# EAGLE schematic RFWBBoard (EAGLE 6.4)
AUTHOR: Benjamin Babjak; AUTHOREMAIL: benjamin.babjak@vanderbilt.edu; COPYRIGHT: Copyright © 2013 Vanderbilt University, ISIS; PAGE1: Cover page; PAGE2: Connector; PAGE3: Baseband signals; PAGE4: RF signals; PAGE5: Control/Digital signals; PAGE6: Clock; PAGE7: Supply; REVIEWER1: Peter Volgyesi; REVIEWER2: Sandor Szilvasi; REVIEWEREMAIL1: peter.volgyesi@vanderbilt.edu; REVIEWEREMAIL2: sandor.szilvasi@vanderbilt.edu; REVISION: B; TITLE: Joshua

## Sheet 1 of 7
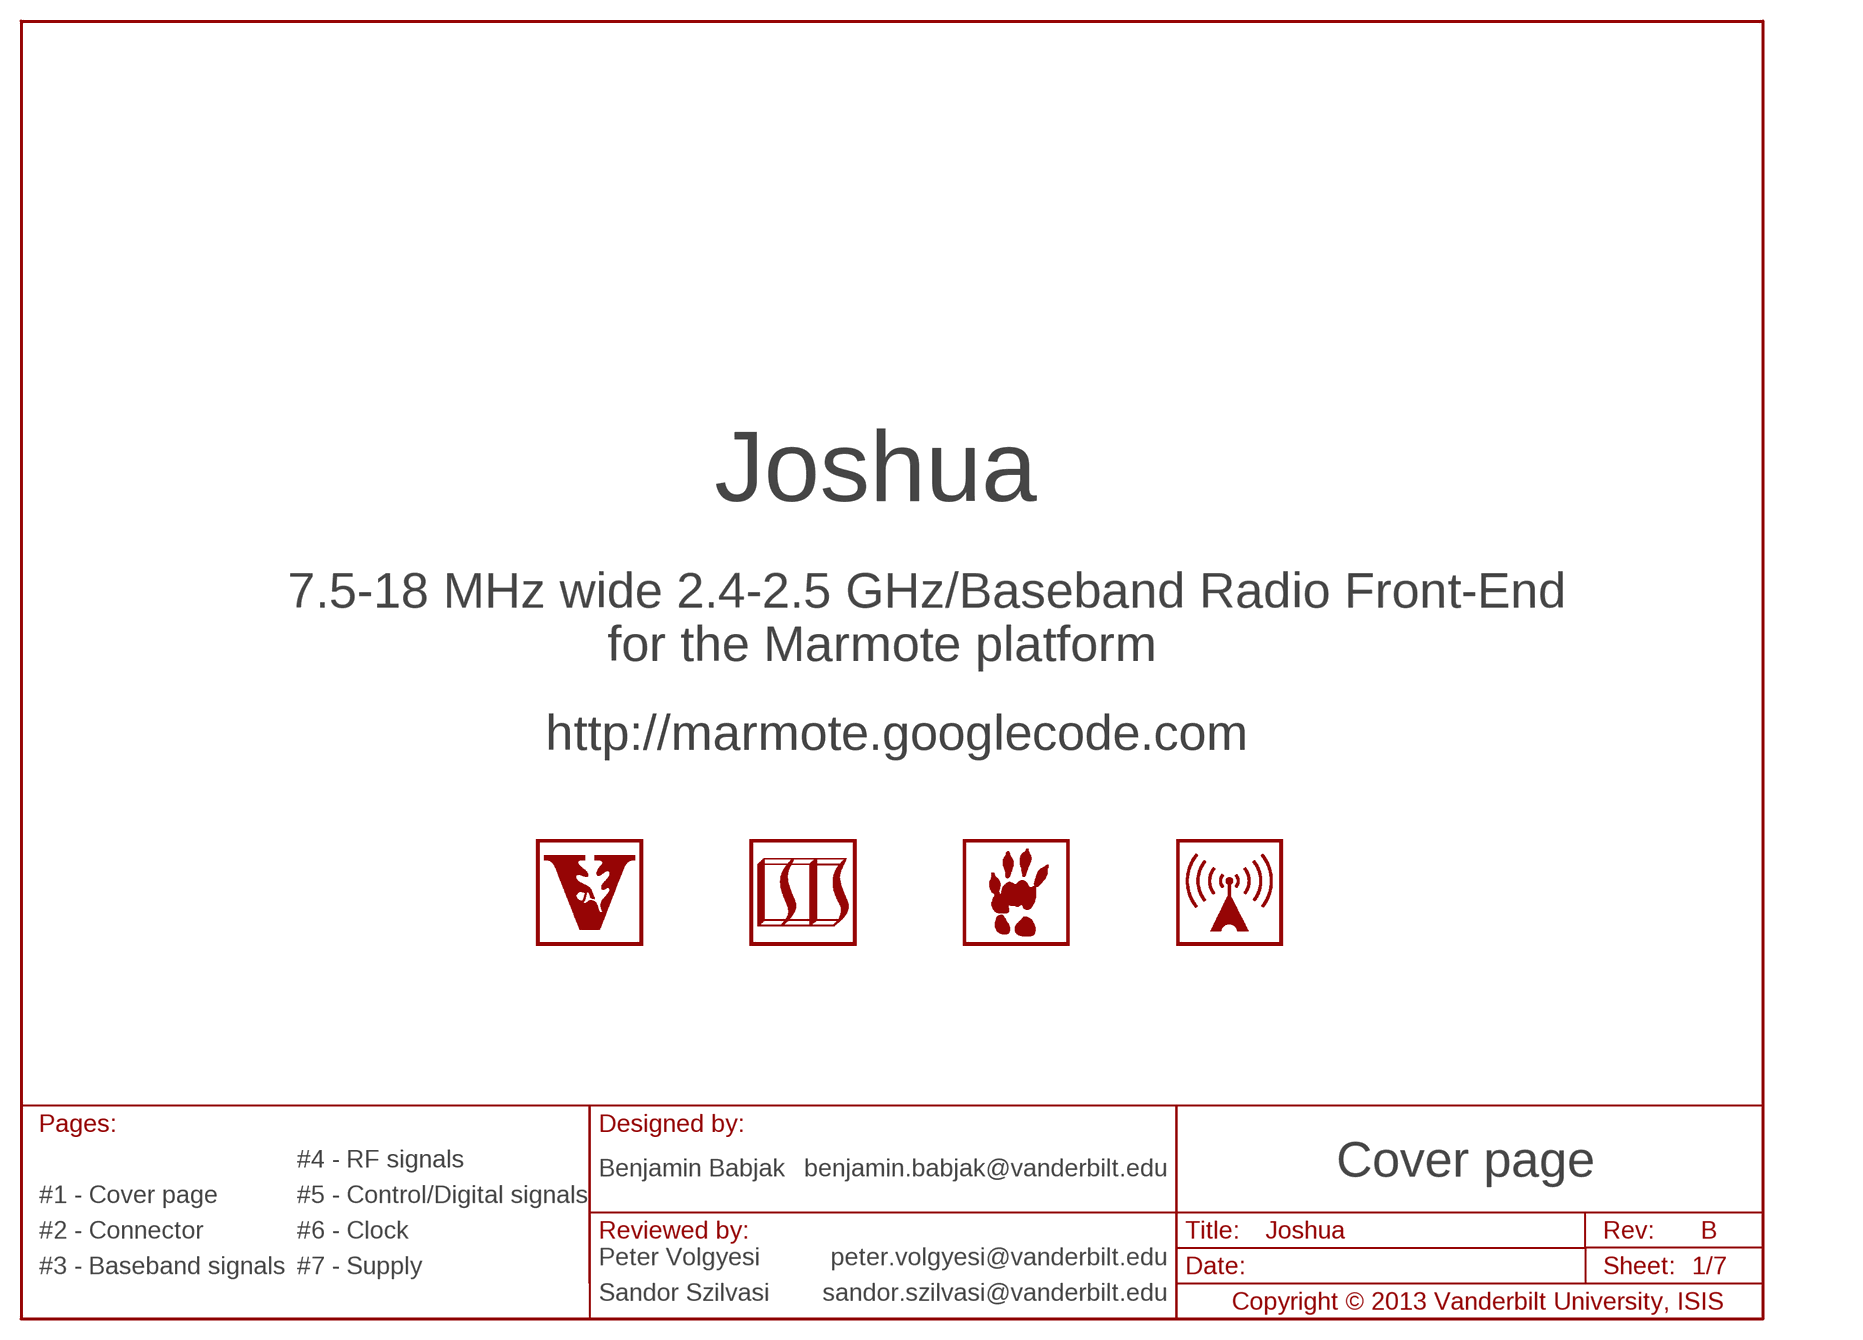
[diagram p0: schematic, sheet 1]

### Parts
LOGO4  LOGO-ISIS-600MIL-10MM-SS  [LOGO-ISIS-10MM-SILKSCREEN]
LOGO5  LOGO-VANDERBILT-600MIL-10MM-SS  [LOGO-VANDERBILT-10MM-SILKSCREEN]
LOGO6  LOGO-MARMOTE-600MIL-10MM-SS  [LOGO-MARMOTE-10MM-SILKSCREEN]
LOGO7  LOGO-RADIO-3-600MIL-10MM-SS  [LOGO-RADIO-FILLED-10MM-SILKSCREEN]

### Notes on the sheet
- 7.5-18 MHz wide 2.4-2.5 GHz/Baseband Radio Front-End
- for the Marmote platform
- http://marmote.googlecode.com

## Sheet 2 of 7
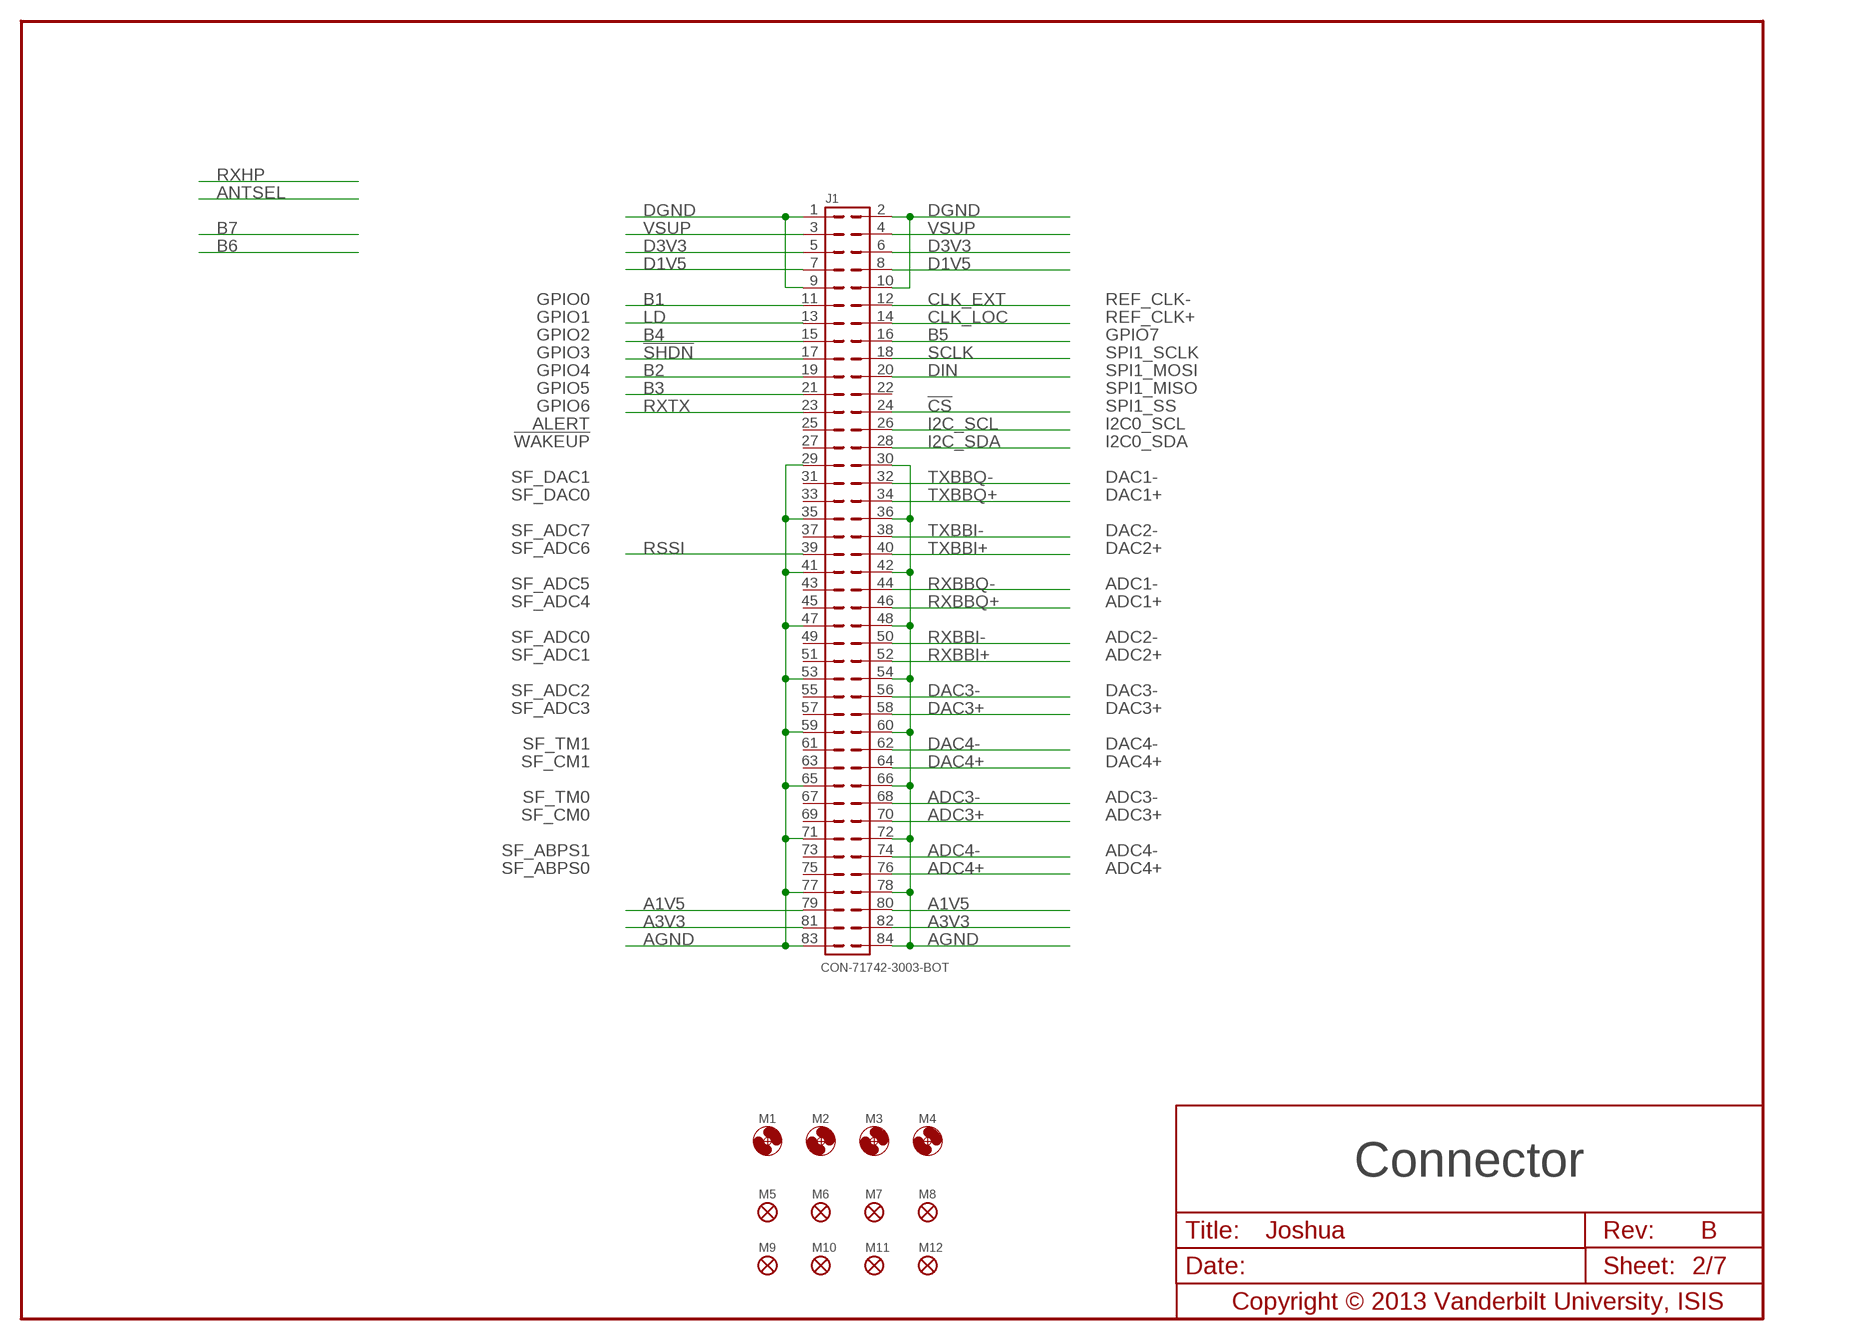
[diagram p1: schematic, sheet 2]

### Parts
J1  CON-71742-3003-BOT  [71742-3003-BOT]
M1  MOUNT-HOLE3.3  [3,3]
M2  MOUNT-HOLE3.3  [3,3]
M3  MOUNT-HOLE3.3  [3,3]
M4  MOUNT-HOLE3.3  [3,3]
M5  FIDUCIAL1X2  [FIDUCIAL-1X2]
M6  FIDUCIAL1X2  [FIDUCIAL-1X2]
M7  FIDUCIAL1X2  [FIDUCIAL-1X2]
M8  FIDUCIAL1X2  [FIDUCIAL-1X2]
M9  FIDUCIAL1X2  [FIDUCIAL-1X2]
M10  FIDUCIAL1X2  [FIDUCIAL-1X2]
M11  FIDUCIAL1X2  [FIDUCIAL-1X2]
M12  FIDUCIAL1X2  [FIDUCIAL-1X2]

### Nets
!CS: J1.24 ; also sheet 5
!SHDN: J1.17 ; also sheet 5
A1V5: J1.79 J1.80
A3V3: J1.81 J1.82 ; also sheet 3,7
ADC3+: J1.70 ; also sheet 3
ADC3-: J1.68 ; also sheet 3
ADC4+: J1.76 ; also sheet 3
ADC4-: J1.74 ; also sheet 3
AGND: J1.29 J1.30 J1.35 J1.36 J1.41 J1.42 J1.47 J1.48 J1.53 J1.54 J1.59 J1.60 J1.65 J1.66 J1.71 J1.72 J1.77 J1.78 J1.83 J1.84 ; also sheet 3,4,6,7
B1: J1.11 ; also sheet 5
B2: J1.19 ; also sheet 5
B3: J1.21 ; also sheet 5
B4: J1.15 ; also sheet 5
B5: J1.16 ; also sheet 5
CLK_EXT: J1.12 ; also sheet 6
CLK_LOC: J1.14 ; also sheet 6
D1V5: J1.7 J1.8
D3V3: J1.5 J1.6 ; also sheet 5,6
DAC3+: J1.58 ; also sheet 3
DAC3-: J1.56 ; also sheet 3
DAC4+: J1.64 ; also sheet 3
DAC4-: J1.62 ; also sheet 3
DGND: J1.1 J1.2 J1.9 J1.10 ; also sheet 5,6,7
DIN: J1.20 ; also sheet 5
I2C_SCL: J1.26 ; also sheet 5
I2C_SDA: J1.28 ; also sheet 5
LD: J1.13 ; also sheet 6
RSSI: J1.39 ; also sheet 5
RXBBI+: J1.52 ; also sheet 4
RXBBI-: J1.50 ; also sheet 4
RXBBQ+: J1.46 ; also sheet 4
RXBBQ-: J1.44 ; also sheet 4
RXTX: J1.23 ; also sheet 5
SCLK: J1.18 ; also sheet 5
TXBBI+: J1.40 ; also sheet 4
TXBBI-: J1.38 ; also sheet 4
TXBBQ+: J1.34 ; also sheet 4
TXBBQ-: J1.32 ; also sheet 4
VSUP: J1.3 J1.4
Unconnected: J1.22 J1.25 J1.27 J1.31 J1.33 J1.37 J1.43 J1.45 J1.49 J1.51 J1.55 J1.57 J1.61 J1.63 J1.67 J1.69 J1.73 J1.75

### Notes on the sheet
- GPIO0 | REF_CLK-
- GPIO1 | REF_CLK+
- GPIO2 | GPIO7
- GPIO3 | SPI1_SCLK
- GPIO4 | SPI1_MOSI
- GPIO5 | SPI1_MISO
- GPIO6 | SPI1_SS
- ALERT | I2C0_SCL
- !WAKEUP | I2C0_SDA
- SF_DAC1 | DAC1-
- SF_DAC0 | DAC1+
- SF_ADC7 | DAC2-
- SF_ADC6 | DAC2+
- SF_ADC5 | ADC1-
- SF_ADC4 | ADC1+
- SF_ADC0 | ADC2-
- SF_ADC1 | ADC2+
- SF_ADC2 | DAC3-
- SF_ADC3 | DAC3+
- SF_TM1 | DAC4-
- SF_CM1 | DAC4+
- SF_TM0 | ADC3-
- SF_CM0 | ADC3+
- SF_ABPS1 | ADC4-
- SF_ABPS0 | ADC4+

## Sheet 3 of 7
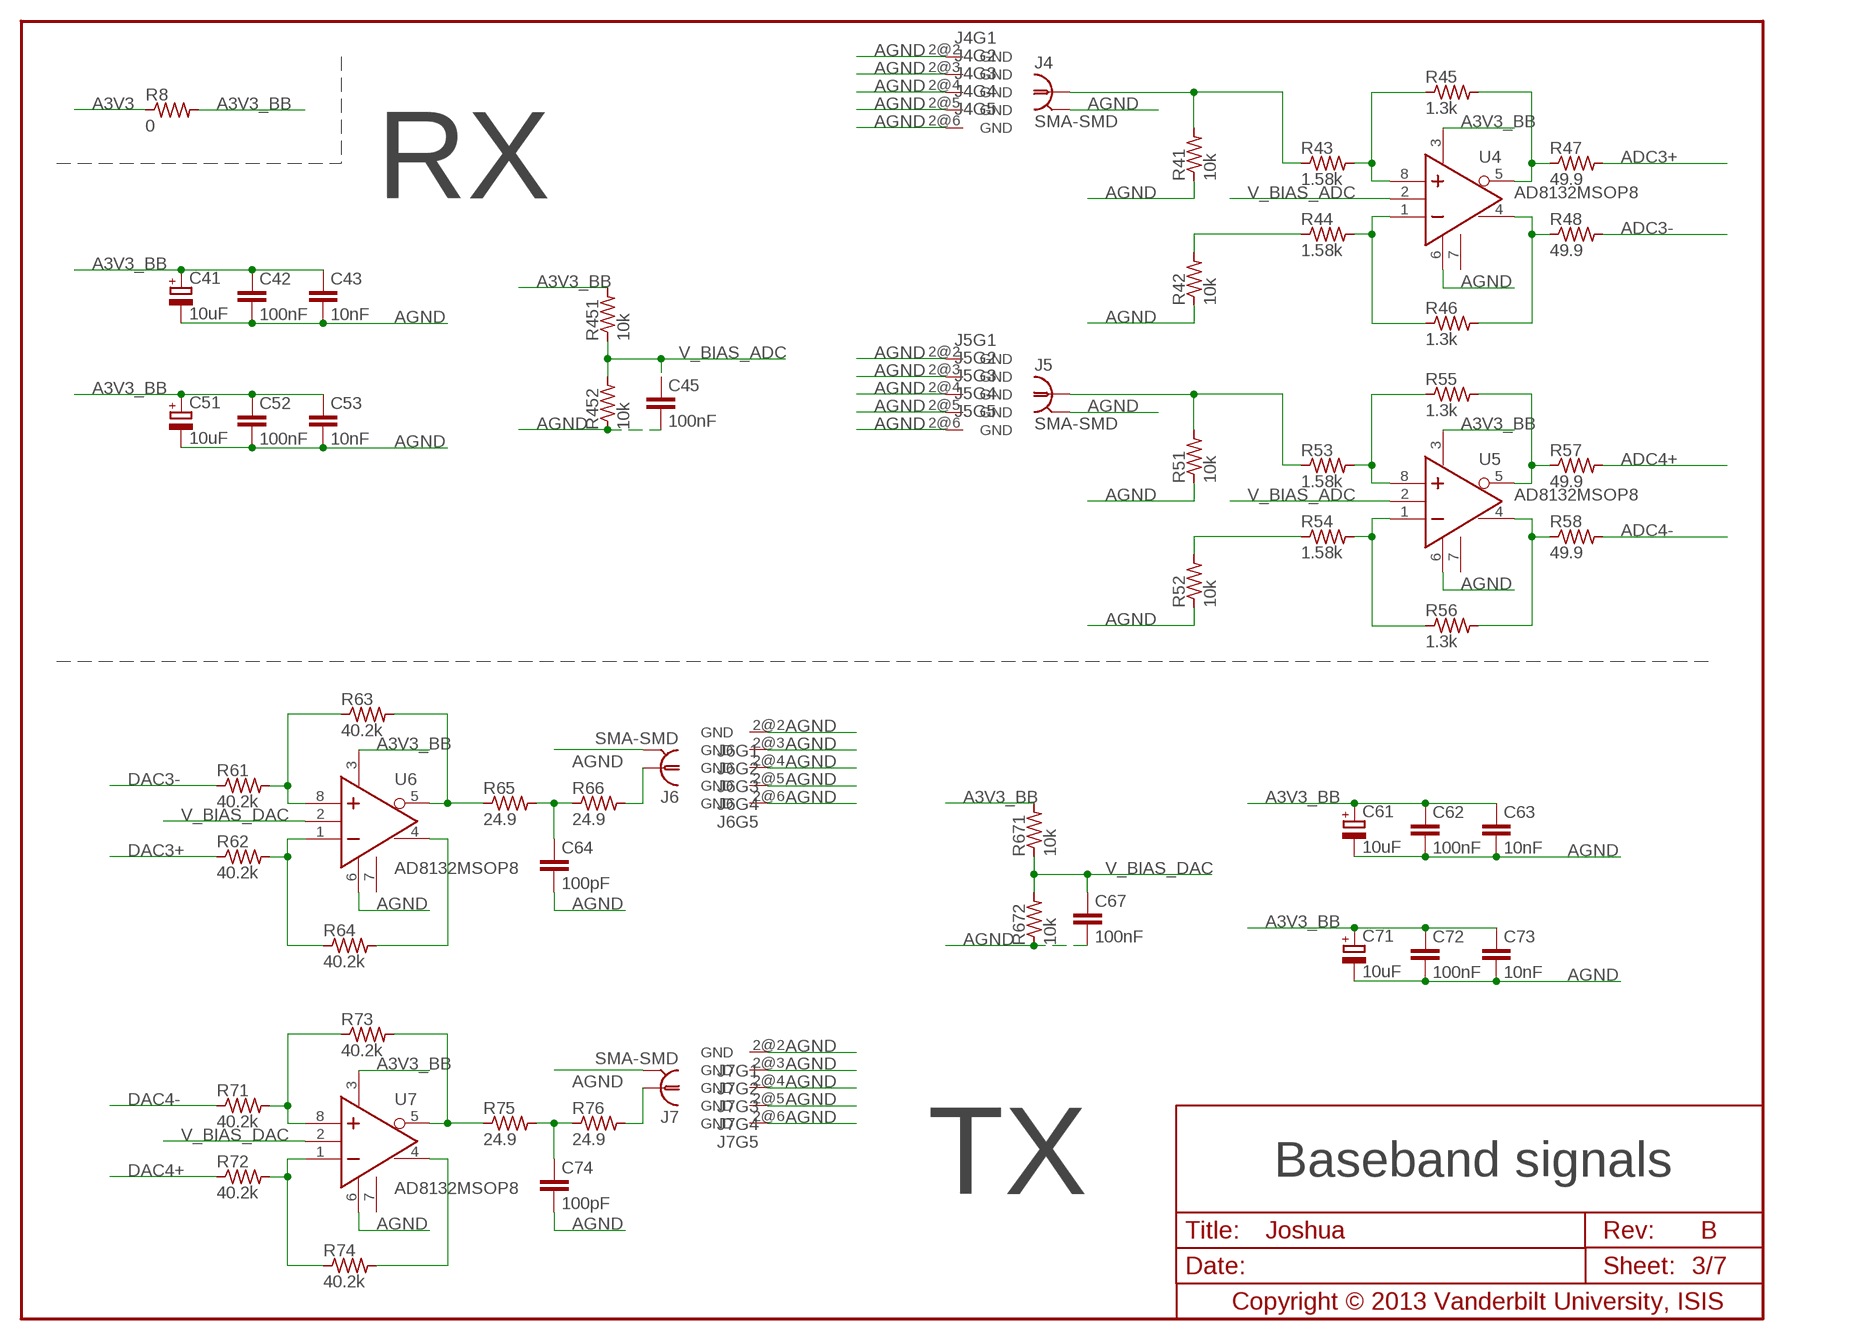
[diagram p2: schematic, sheet 3]

### Parts
C41  10uF  CPOL2012  [CPOL2012]
C42  100nF  C0402  [C0402]
C43  10nF  C0402  [C0402]
C45  100nF  C0402  [C0402]
C51  10uF  CPOL2012  [CPOL2012]
C52  100nF  C0402  [C0402]
C53  10nF  C0402  [C0402]
C61  10uF  CPOL2012  [CPOL2012]
C62  100nF  C0402  [C0402]
C63  10nF  C0402  [C0402]
C64  100pF  C0402  [C0402]
C67  100nF  C0402  [C0402]
C71  10uF  CPOL2012  [CPOL2012]
C72  100nF  C0402  [C0402]
C73  10nF  C0402  [C0402]
C74  100pF  C0402  [C0402]
J4  SMA-SMD  [SMA-SMD]
J5  SMA-SMD  [SMA-SMD]
J6  SMA-SMD  [SMA-SMD]
J7  SMA-SMD  [SMA-SMD]
R8  0  R1206  [R1206]
R41  10k  R0402  [R0402]
R42  10k  R0402  [R0402]
R43  1.58k  R0402  [R0402]
R44  1.58k  R0402  [R0402]
R45  1.3k  R0402  [R0402]
R46  1.3k  R0402  [R0402]
R47  49.9  R0402  [R0402]
R48  49.9  R0402  [R0402]
R51  10k  R0402  [R0402]
R52  10k  R0402  [R0402]
R53  1.58k  R0402  [R0402]
R54  1.58k  R0402  [R0402]
R55  1.3k  R0402  [R0402]
R56  1.3k  R0402  [R0402]
R57  49.9  R0402  [R0402]
R58  49.9  R0402  [R0402]
R61  40.2k  R0402  [R0402]
R62  40.2k  R0402  [R0402]
R63  40.2k  R0402  [R0402]
R64  40.2k  R0402  [R0402]
R65  24.9  R0402  [R0402]
R66  24.9  R0402  [R0402]
R71  40.2k  R0402  [R0402]
R72  40.2k  R0402  [R0402]
R73  40.2k  R0402  [R0402]
R74  40.2k  R0402  [R0402]
R75  24.9  R0402  [R0402]
R76  24.9  R0402  [R0402]
R451  10k  R0402  [R0402]
R452  10k  R0402  [R0402]
R671  10k  R0402  [R0402]
R672  10k  R0402  [R0402]
U4  AD8132MSOP8  [MSOP8]
U5  AD8132MSOP8  [MSOP8]
U6  AD8132MSOP8  [MSOP8]
U7  AD8132MSOP8  [MSOP8]

### Nets
A3V3: R8.1 ; also sheet 2,7
A3V3_BB: C41.+ C42.1 C43.1 C51.+ C52.1 C53.1 C61.+ C62.1 C63.1 C71.+ C72.1 C73.1 R8.2 R451.2 R671.2 U4.3(V_S+) U5.3(V_S+) U6.3(V_S+) U7.3(V_S+)
ADC3+: R47.2 ; also sheet 2
ADC3-: R48.2 ; also sheet 2
ADC4+: R57.2 ; also sheet 2
ADC4-: R58.2 ; also sheet 2
AGND: C41.- C42.2 C43.2 C45.2 C51.- C52.2 C53.2 C61.- C62.2 C63.2 C64.2 C67.2 C71.- C72.2 C73.2 C74.2 J4.2@1(GND) J4.2@2(GND) J4.2@3(GND) J4.2@4(GND) J4.2@5(GND) J4.2@6(GND) J5.2@1(GND) J5.2@2(GND) J5.2@3(GND) J5.2@4(GND) J5.2@5(GND) J5.2@6(GND) J6.2@1(GND) J6.2@2(GND) J6.2@3(GND) J6.2@4(GND) J6.2@5(GND) J6.2@6(GND) J7.2@1(GND) J7.2@2(GND) J7.2@3(GND) J7.2@4(GND) J7.2@5(GND) J7.2@6(GND) R41.1 R42.1 R51.1 R52.1 R452.1 R672.1 U4.6(V_S-) U5.6(V_S-) U6.6(V_S-) U7.6(V_S-) ; also sheet 2,4,6,7
DAC3+: R62.1 ; also sheet 2
DAC3-: R61.1 ; also sheet 2
DAC4+: R72.1 ; also sheet 2
DAC4-: R71.1 ; also sheet 2
N$11: J4.1 R41.2 R43.1
N$12: R45.2 R47.1 U4.5(-OUT)
N$13: R46.2 R48.1 U4.4(+OUT)
N$14: R43.2 R45.1 U4.8(+IN)
N$15: R44.2 R46.1 U4.1(-IN)
N$16: J5.1 R51.2 R53.1
N$17: R42.2 R44.1
N$18: R55.2 R57.1 U5.5(-OUT)
N$19: R56.2 R58.1 U5.4(+OUT)
N$20: R53.2 R55.1 U5.8(+IN)
N$21: R54.2 R56.1 U5.1(-IN)
N$22: R52.2 R54.1
N$23: R61.2 R63.1 U6.8(+IN)
N$24: R62.2 R64.1 U6.1(-IN)
N$25: R63.2 R65.1 U6.5(-OUT)
N$26: R64.2 U6.4(+OUT)
N$27: C64.1 R65.2 R66.1
N$28: R71.2 R73.1 U7.8(+IN)
N$29: J6.1 R66.2
N$30: R72.2 R74.1 U7.1(-IN)
N$31: R73.2 R75.1 U7.5(-OUT)
N$32: R74.2 U7.4(+OUT)
N$33: C74.1 R75.2 R76.1
N$34: J7.1 R76.2
V_BIAS_ADC: C45.1 R451.1 R452.2 U4.2(V_OCM) U5.2(V_OCM)
V_BIAS_DAC: C67.1 R671.1 R672.2 U6.2(V_OCM) U7.2(V_OCM)
Unconnected: U4.7(PD) U5.7(PD) U6.7(PD) U7.7(PD)

### Notes on the sheet
- RX
- TX

## Sheet 4 of 7
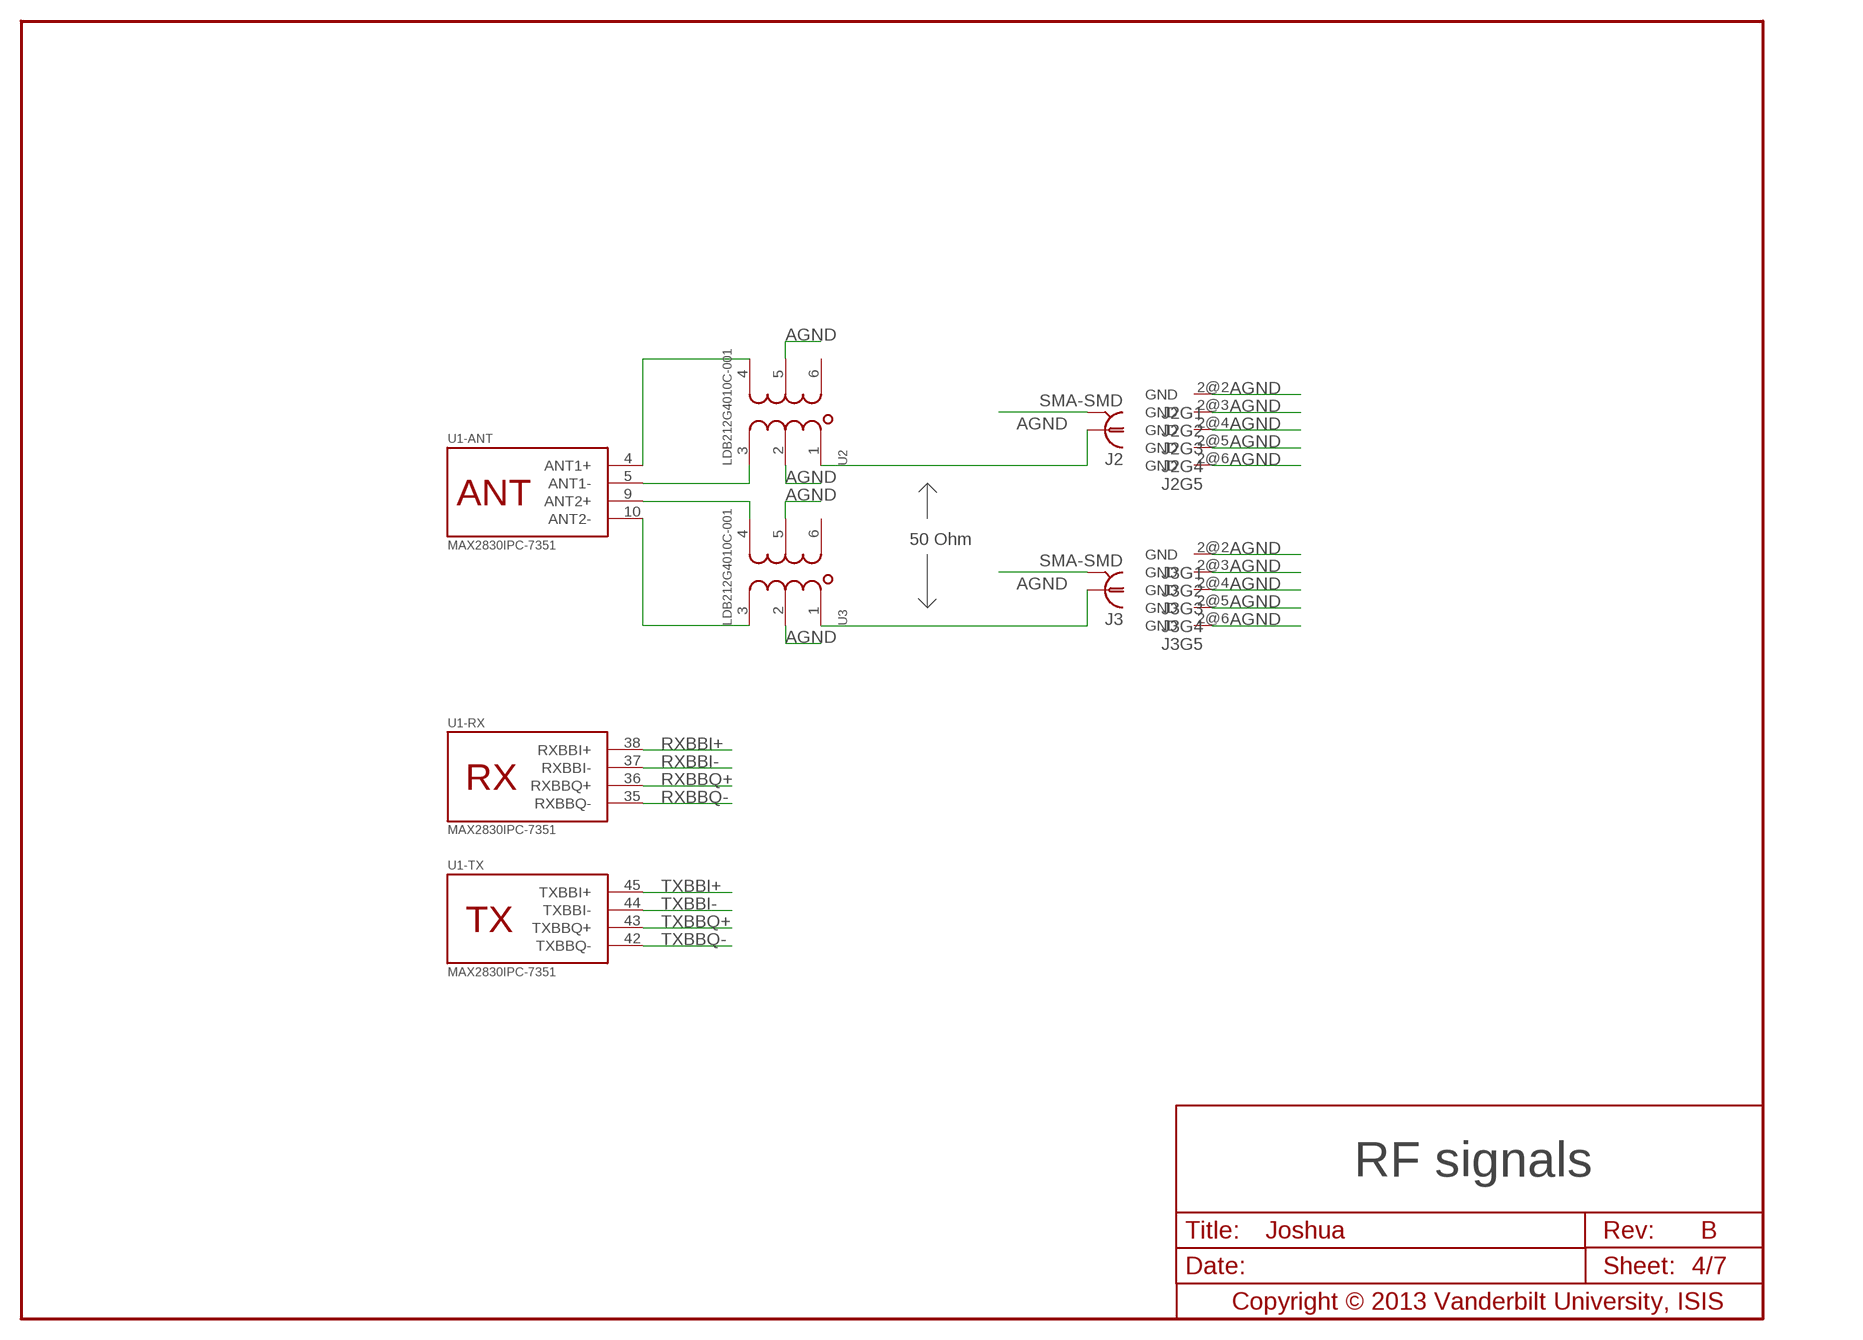
[diagram p3: schematic, sheet 4]

### Parts
J2  SMA-SMD  [SMA-SMD]
J3  SMA-SMD  [SMA-SMD]
U1  MAX2830IPC-7351  [TQFN-48]
U2  LDB212G4010C-001  [LDB21-FOOTPRINT]
U3  LDB212G4010C-001  [LDB21-FOOTPRINT]

### Nets
AGND: J2.2@1(GND) J2.2@2(GND) J2.2@3(GND) J2.2@4(GND) J2.2@5(GND) J2.2@6(GND) J3.2@1(GND) J3.2@2(GND) J3.2@3(GND) J3.2@4(GND) J3.2@5(GND) J3.2@6(GND) U2.2 U2.5 U3.2 U3.5 ; also sheet 2,3,6,7
N$1: U1.4(-ANT:ANT1+) U2.4
N$2: U1.5(-ANT:ANT1-) U2.3
N$3: U1.10(-ANT:ANT2-) U3.3
N$4: U1.9(-ANT:ANT2+) U3.4
N$8: J2.1 U2.1
N$9: J3.1 U3.1
RXBBI+: U1.38(-RX:RXBBI+) ; also sheet 2
RXBBI-: U1.37(-RX:RXBBI-) ; also sheet 2
RXBBQ+: U1.36(-RX:RXBBQ+) ; also sheet 2
RXBBQ-: U1.35(-RX:RXBBQ-) ; also sheet 2
TXBBI+: U1.45(-TX:TXBBI+) ; also sheet 2
TXBBI-: U1.44(-TX:TXBBI-) ; also sheet 2
TXBBQ+: U1.43(-TX:TXBBQ+) ; also sheet 2
TXBBQ-: U1.42(-TX:TXBBQ-) ; also sheet 2
Unconnected: U2.6 U3.6

### Notes on the sheet
- 50 Ohm

## Sheet 5 of 7
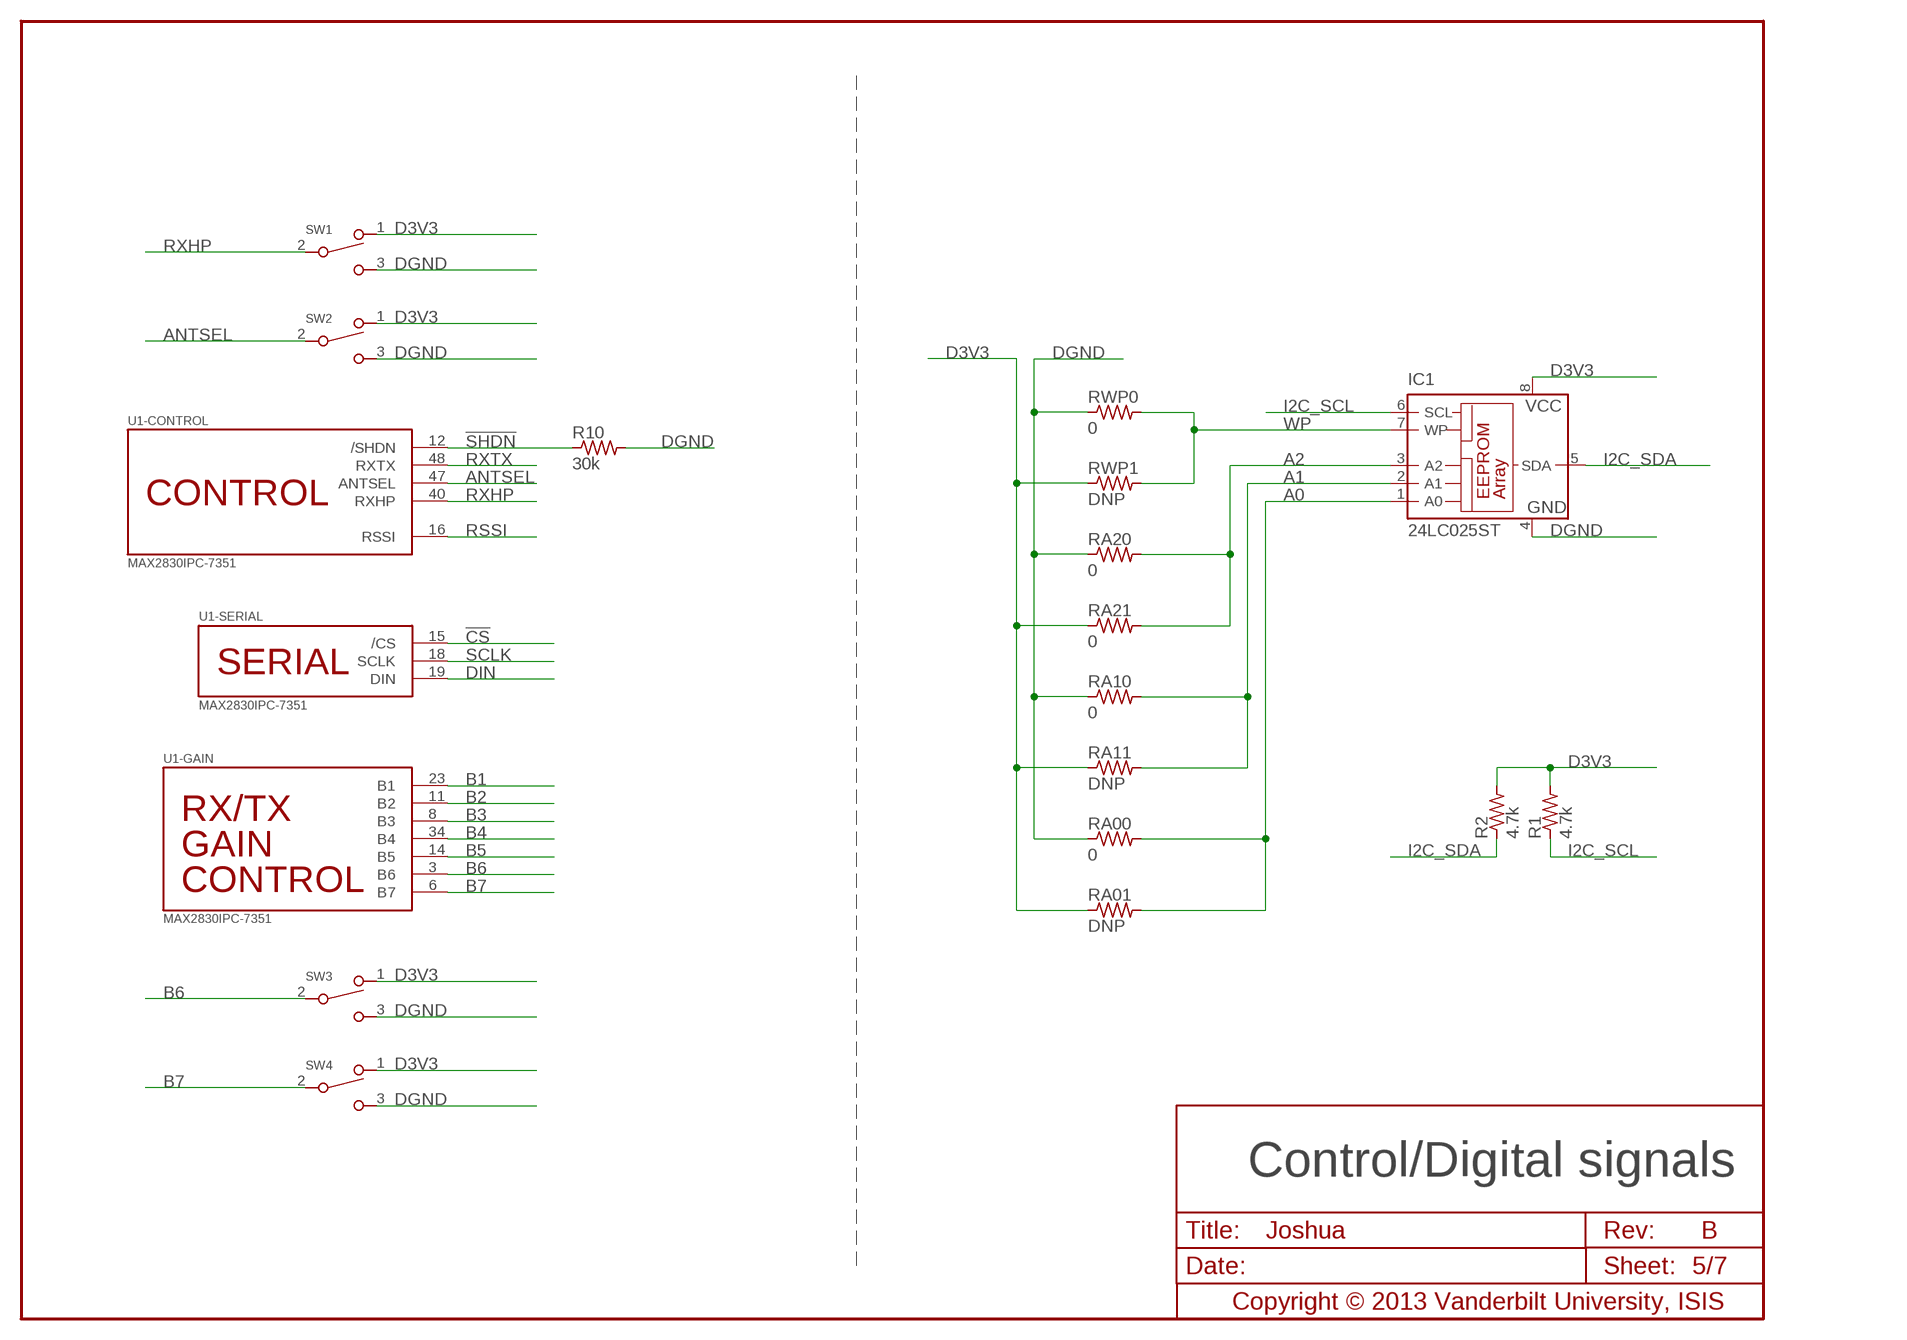
[diagram p4: schematic, sheet 5]

### Parts
IC1  24LC025ST  [TSSOP8]
R1  4.7k  R0402  [R0402]
R2  4.7k  R0402  [R0402]
R10  30k  R0402  [R0402]
RA00  0  R0402  [R0402]
RA01  DNP  R0402  [R0402]
RA10  0  R0402  [R0402]
RA11  DNP  R0402  [R0402]
RA20  0  R0402  [R0402]
RA21  0  R0402  [R0402]
RWP0  0  R0402  [R0402]
RWP1  DNP  R0402  [R0402]
SW1  SWITCH-CJS-1200TA  [SWITCH-DIP-CJS]
SW2  SWITCH-CJS-1200TA  [SWITCH-DIP-CJS]
SW3  SWITCH-CJS-1200TA  [SWITCH-DIP-CJS]
SW4  SWITCH-CJS-1200TA  [SWITCH-DIP-CJS]

### Nets
!CS: U1.15(-SERIAL:/CS) ; also sheet 2
!SHDN: R10.1 U1.12(-CONTROL:/SHDN) ; also sheet 2
A0: IC1.1(A0) RA00.2 RA01.2
A1: IC1.2(A1) RA10.2 RA11.2
A2: IC1.3(A2) RA20.2 RA21.2
ANTSEL: SW2.2 U1.47(-CONTROL:ANTSEL) ; also sheet 2
B1: U1.23(-GAIN:B1) ; also sheet 2
B2: U1.11(-GAIN:B2) ; also sheet 2
B3: U1.8(-GAIN:B3) ; also sheet 2
B4: U1.34(-GAIN:B4) ; also sheet 2
B5: U1.14(-GAIN:B5) ; also sheet 2
B6: SW3.2 U1.3(-GAIN:B6) ; also sheet 2
B7: SW4.2 U1.6(-GAIN:B7) ; also sheet 2
D3V3: IC1.8(VCC) R1.2 R2.2 RA01.1 RA11.1 RA21.1 RWP1.1 SW1.1 SW2.1 SW3.1 SW4.1 ; also sheet 2,6
DGND: IC1.4(GND) R10.2 RA00.1 RA10.1 RA20.1 RWP0.1 SW1.3 SW2.3 SW3.3 SW4.3 ; also sheet 2,6,7
DIN: U1.19(-SERIAL:DIN) ; also sheet 2
I2C_SCL: IC1.6(SCL) R1.1 ; also sheet 2
I2C_SDA: IC1.5(SDA) R2.1 ; also sheet 2
RSSI: U1.16(-CONTROL:RSSI) ; also sheet 2
RXHP: SW1.2 U1.40(-CONTROL:RXHP) ; also sheet 2
RXTX: U1.48(-CONTROL:RXTX) ; also sheet 2
SCLK: U1.18(-SERIAL:SCLK) ; also sheet 2
WP: IC1.7(WP) RWP0.2 RWP1.2

## Sheet 6 of 7
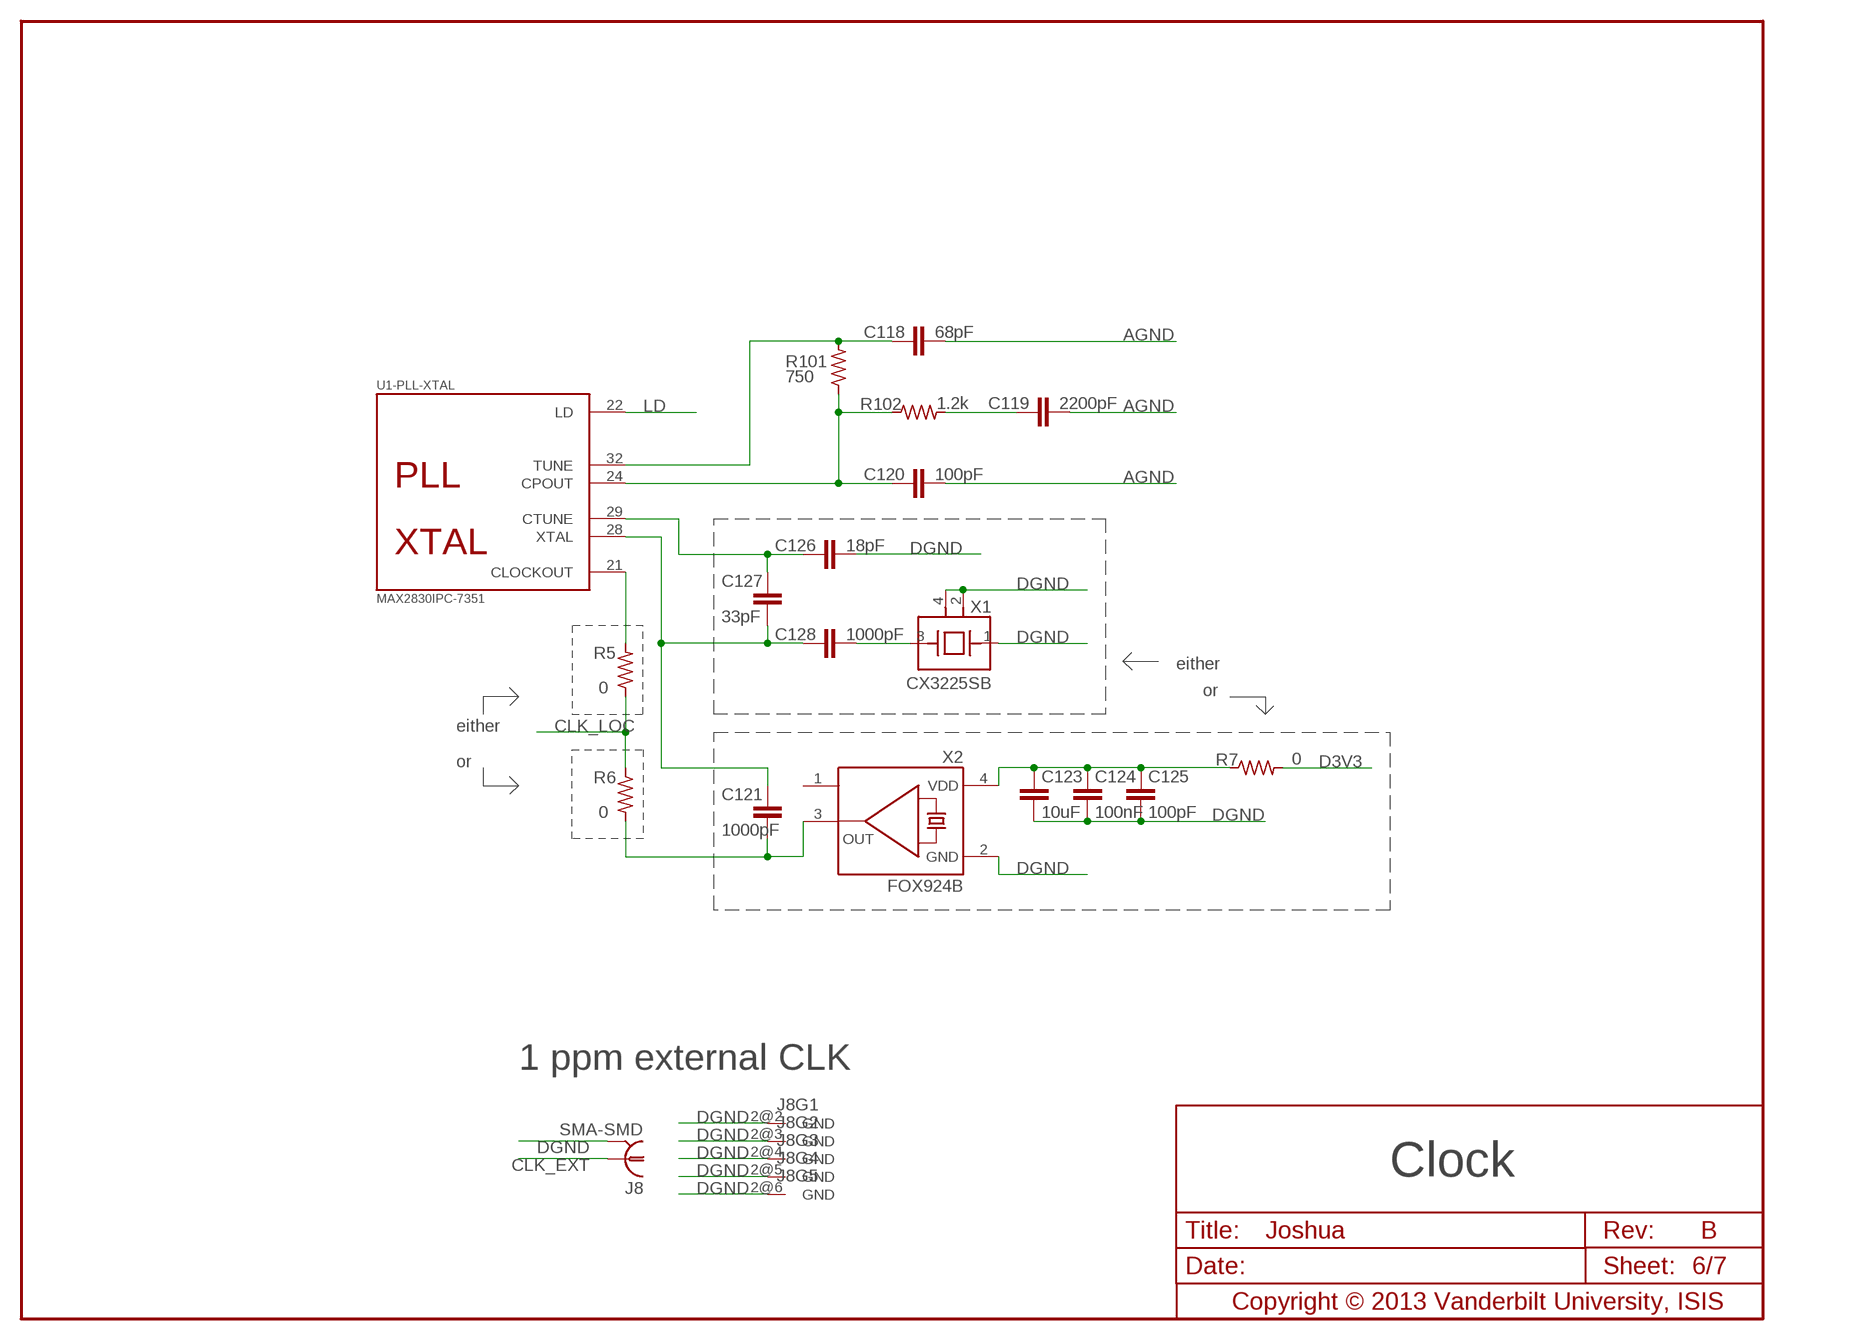
[diagram p5: schematic, sheet 6]

### Parts
C118  68pF  C0402  [C0402]
C119  2200pF  C0402  [C0402]
C120  100pF  C0402  [C0402]
C121  1000pF  C0402  [C0402]
C123  10uF  C0805  [C0805]
C124  100nF  C0402  [C0402]
C125  100pF  C0402  [C0402]
C126  18pF  C0402  [C0402]
C127  33pF  C0402  [C0402]
C128  1000pF  C0402  [C0402]
J8  SMA-SMD  [SMA-SMD]
R5  0  R0402  [R0402]
R6  0  R0402  [R0402]
R7  0  R1206  [R1206]
R101  750  R0402  [R0402]
R102  1.2k  R0402  [R0402]
X1  CX3225SB  [CX3225SB]
X2  FOX924B  [FOX924]

### Nets
AGND: C118.2 C119.2 C120.2 ; also sheet 2,3,4,7
CLK_EXT: J8.1 ; also sheet 2
CLK_LOC: R5.1 R6.1 ; also sheet 2
D3V3: R7.2 ; also sheet 2,5
DGND: C123.2 C124.2 C125.2 C126.1 J8.2@1(GND) J8.2@2(GND) J8.2@3(GND) J8.2@4(GND) J8.2@5(GND) J8.2@6(GND) X1.1 X1.2 X1.4 X2.2(GND) ; also sheet 2,5,7
LD: U1.22(-PLL-XTAL:LD) ; also sheet 2
N$5: C118.1 R101.2 U1.32(-PLL-XTAL:TUNE)
N$6: C121.1 C127.2 C128.2 U1.28(-PLL-XTAL:XTAL)
N$7: C119.1 R102.2
N$10: C120.1 R101.1 R102.1 U1.24(-PLL-XTAL:CPOUT)
N$36: C121.2 R6.2 X2.3(FO)
N$37: C123.1 C124.1 C125.1 R7.1 X2.4(VCC)
N$38: R5.2 U1.21(-PLL-XTAL:CLOCKOUT)
N$39: C128.1 X1.3
N$40: C126.2 C127.1 U1.29(-PLL-XTAL:CTUNE)
Unconnected: X2.1(NC)

### Notes on the sheet
- either
- or
- either
- or
- 1 ppm external CLK

## Sheet 7 of 7
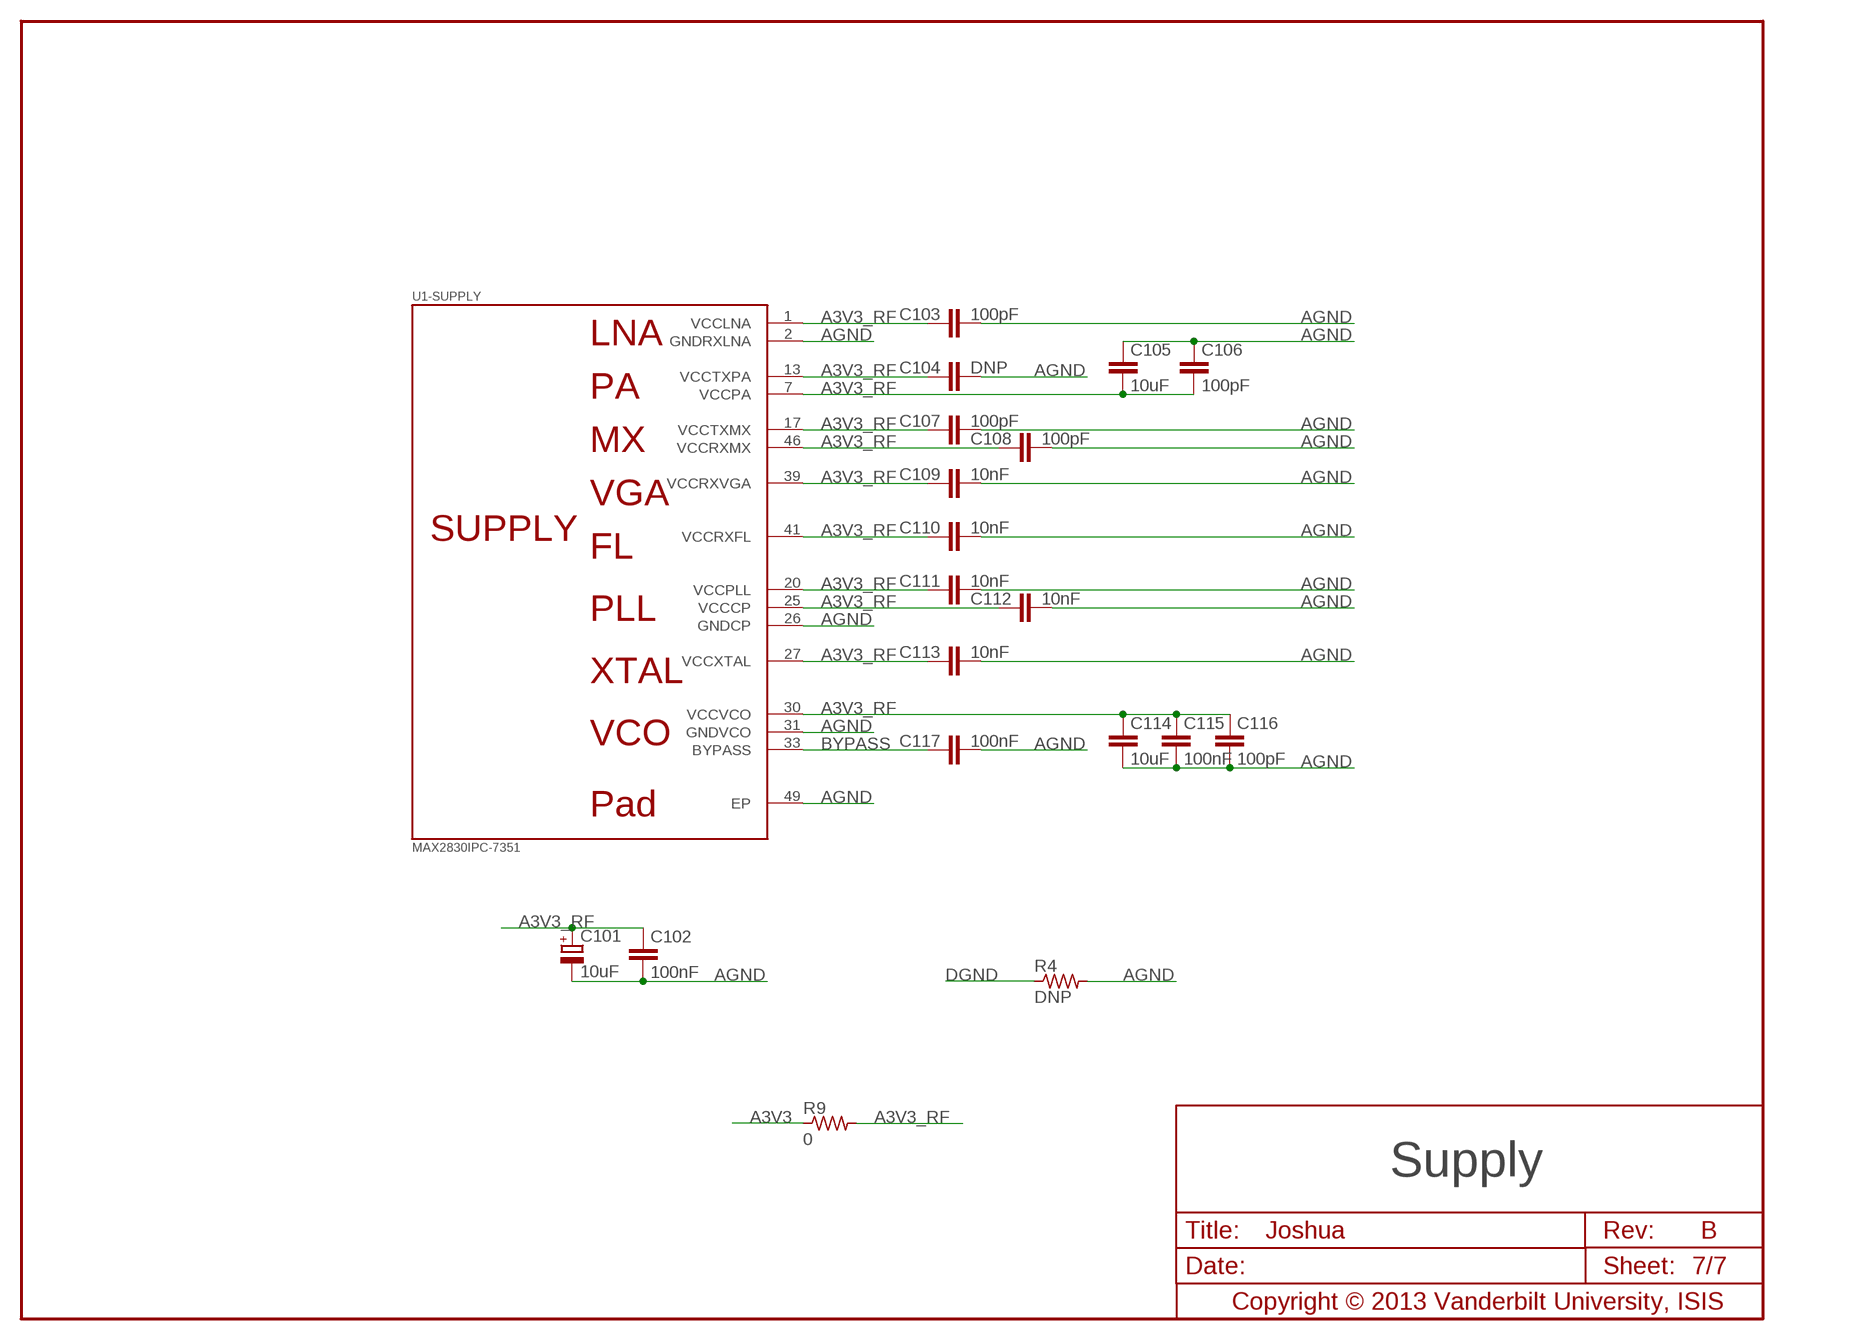
[diagram p6: schematic, sheet 7]

### Parts
C101  10uF  CPOL2012  [CPOL2012]
C102  100nF  C0402  [C0402]
C103  100pF  C0402  [C0402]
C104  DNP  C0402  [C0402]
C105  10uF  C1206  [C1206]
C106  100pF  C0402  [C0402]
C107  100pF  C0402  [C0402]
C108  100pF  C0402  [C0402]
C109  10nF  C0402  [C0402]
C110  10nF  C0402  [C0402]
C111  10nF  C0402  [C0402]
C112  10nF  C0402  [C0402]
C113  10nF  C0402  [C0402]
C114  10uF  C0805  [C0805]
C115  100nF  C0402  [C0402]
C116  100pF  C0402  [C0402]
C117  100nF  C0402  [C0402]
R4  DNP  R1206  [R1206]
R9  0  R1206  [R1206]

### Nets
A3V3: R9.1 ; also sheet 2,3
A3V3_RF: C101.+ C102.1 C103.1 C104.1 C105.2 C106.2 C107.1 C108.1 C109.1 C110.1 C111.1 C112.1 C113.1 C114.1 C115.1 C116.1 R9.2 U1.1(-SUPPLY:VCCLNA) U1.7(-SUPPLY:VCCPA) U1.13(-SUPPLY:VCCTXPA) U1.17(-SUPPLY:VCCTXMX) U1.20(-SUPPLY:VCCPLL) U1.25(-SUPPLY:VCCCP) U1.27(-SUPPLY:VCCXTAL) U1.30(-SUPPLY:VCCVCO) U1.39(-SUPPLY:VCCRXVGA) U1.41(-SUPPLY:VCCRXFL) U1.46(-SUPPLY:VCCRXMX)
AGND: C101.- C102.2 C103.2 C104.2 C105.1 C106.1 C107.2 C108.2 C109.2 C110.2 C111.2 C112.2 C113.2 C114.2 C115.2 C116.2 C117.2 R4.2 U1.2(-SUPPLY:GNDRXLNA) U1.26(-SUPPLY:GNDCP) U1.31(-SUPPLY:GNDVCO) U1.49(-SUPPLY:EP) ; also sheet 2,3,4,6
BYPASS: C117.1 U1.33(-SUPPLY:BYPASS)
DGND: R4.1 ; also sheet 2,5,6

## Library data of the parts
C41 C51 C61 C71 C101 = RFWBBoard:CPOL: POLARIZED CAPACITOR Tantalum capacitors
C42 C43 C45 C52 C53 C62-C64 C67 C72-C74 C102-C121 C123-C128 = RFWBBoard:C: CAPACITOR
IC1 = RFWBBoard:24*: Serial EEPROM I2C; MF: MICROCHIP; MPN: 24LC025-I/ST; OC_FARNELL: unknown; OC_NEWARK: 92C7100
J1 = RFWBBoard:CON-71742: Board-to-Board Connector 1.00mm (.039") Mezzanine IEEE 1386 Receptacle - Dual Row 64-pin, SMT, Vertical Stacking Source: http://www.molex.com/molex/products/datasheet.jsp?part=active/0714392164_PCB_RECEPTACLES.xml&channel=Products
J2-J8 = RFWBBoard:SMA-SMD: SMA 50 Ohm Straight Jack Receptacle - Surface Mount www.johnsoncomponents.com Source: http://catalog.digikey.com .. 142-0711-201, 205, 202, 206.pdf; OC_FARNELL: unknown; OC_NEWARK: unknown
LOGO4 = Logo:LOGO-ISIS-600MIL: ISIS Logo Official logo of the Institute for Software Integrated Systems (ISIS), Vanderbilt as of 2011 Generated from 360 x 360 px bitmap and scaled to 600 x 600 mil v1.0 Initial design
LOGO5 = Logo:LOGO-VANDERBILT-600MIL: Vanderbilt Logo Official Framed Vanderbilt Logo Generated from 360 x 360 px bitmap and scaled to 600 x 600 mil v1.1 Source bitmap smoothened v1.0 Initial design
LOGO6 = Logo:LOGO-MARMOTE-600MIL: Marmote Platform Logo Preliminary logo for the Marmote Platform (http://marmote.googlecode.com) Generated from 360 x 360 px bitmap and scaled to 600 x 600 mil v1.1 Source bitmap smoothened v1.0 Initial design
LOGO7 = Logo:LOGO-RADIO-3-600MIL: Radio Logo Preliminary logo for the Marmote platform analog radio front-end module. Generated from 360 x 360 px bitmap and scaled to 600 x 600 mil v1.0 Initial design
M1-M4 = RFWBBoard:MOUNT-HOLE: MOUNTING HOLE with drill center marker
M5-M12 = RFWBBoard:FIDUCIAL: Fiducial Alignment Points Various fiducial points for machine vision alignment.
R1 R2 R4-R10 R41-R48 R51-R58 R61-R66 R71-R76 R101 R102 R451 R452 R671 R672 RA00 RA01 RA10 RA11 RA20 RA21 RWP0 RWP1 = RFWBBoard:R: RESISTOR
SW1-SW4 = RFWBBoard:SWITCH-CJS-1200: CJS-1200 SPDT Switch Source: http://media.digikey.com/pdf/Data%20Sheets/COPAL%20Electronics%20PDFs/CJS.pdf; DIGI-KEY#: 563-1021-1-ND; MF: CJS; MPN: CJS-1200TA
U1 = RFWBBoard:MAX2830: The MAX2830 direct conversion, zero-IF, RF transceiver is designed specifically for 2.4GHz to 2.5GHz 802.11g/b WLAN applications. The MAX2830 completely integrates all circuitry required to implement the RF transceiver function, providing an RF power amplifier (PA), an Rx/Tx and antenna diversity switch, RF-to-baseband receive path, baseband-to-RF transmit path, voltage-controlled oscillator (VCO), frequency synthesizer, crystal oscillator, and baseband/control interface. The MAX2830 includes a fast-settling sigma-delta RF synthesizer with smaller than 20Hz frequency steps and a digitally tuned crystal oscillator allowing use of a low-cost crystal. No I/Q calibration is required; however, the device also integrates on-chip DC-offset cancellation and I/Q errors and carrier leakage-detection circuits for improved performance. Only an RF bandpass filter (BPF), crystal, a pair of baluns, and a small number of passive components are needed to form a complete 802.11g/b WLAN RF front-end solution. http://www.maxim-ic.com/datasheet/index.mvp/id/5367/t/al http://datasheets.maxim-ic.com/en/ds/MAX2830.pdf
U2 U3 = RFWBBoard:LDB212G4010C-001: Murata Electronics LDB212G4010C-001 Chip Multilayer Hybrid Balun 6-Pin
U4-U7 = RFWBBoard:AD8132
X1 = RFWBBoard:CX3225SB: CX3225SB Compact SMD crystal in 3.2 x 2.5 x 0.55 mm ceramic package. Source: http://global.kyocera.com/prdct/electro/pdf/xtal/cx3225sb_cs_e.pdf Note: Device has two GND pins named DGND
X2 = RFWBBoard:FOX924B: FOX924B 3.3V SMD TCXO Compact 3.3 V ultra miniature SMD HCMOS temperature compenstated crystall oscillator (TCXO) in 5 x 3.2 x 1.5 mm package. Source: http://www.foxonline.com/pdfs/fox924.pdf; DIGI-KEY#: 631-1073-1-ND; FREQ: 20 MHz; MF: Fox Electronics; MPN: FOX924B-20.000